# EAGLE design HandController (EAGLE 5.11)
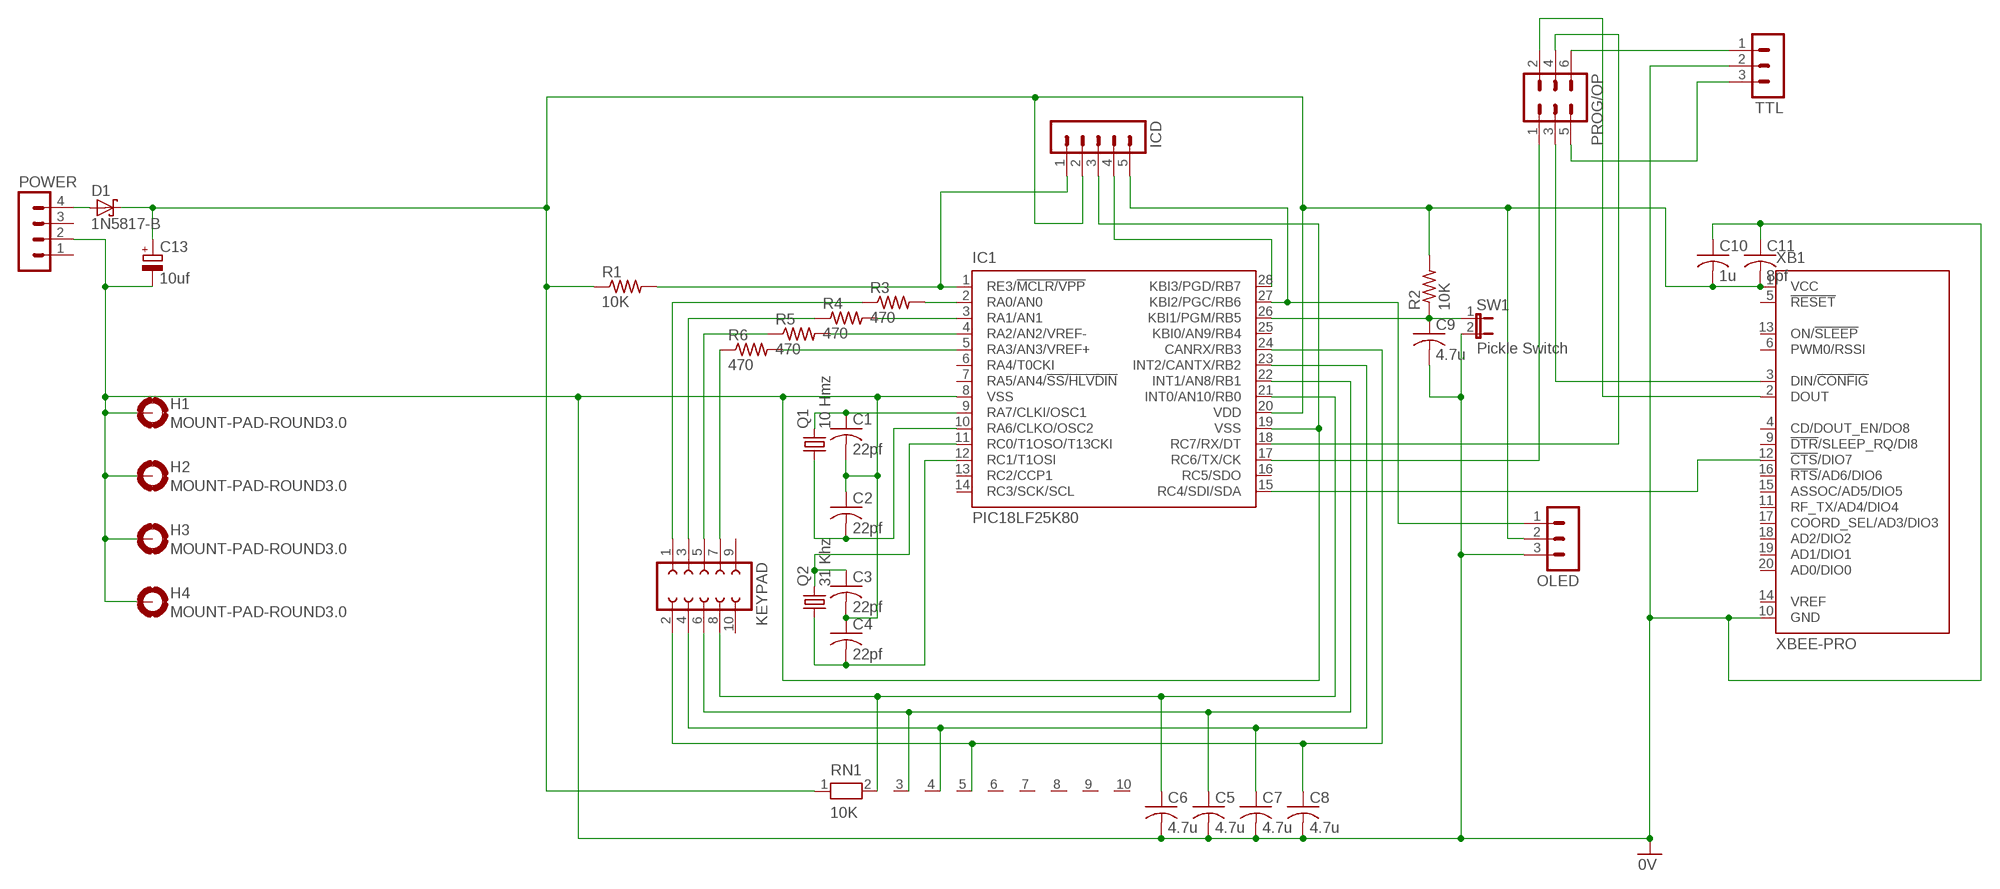
[diagram p0: schematic, sheet 1]

## Parts
C1  22pf  C-US025-024X044  [C025-024X044]
C2  22pf  C-US025-024X044  [C025-024X044]
C3  22pf  C-US025-024X044  [C025-024X044]
C4  22pf  C-US025-024X044  [C025-024X044]
C5  4.7u  C-US025-024X044  [C025-024X044]
C6  4.7u  C-US025-024X044  [C025-024X044]
C7  4.7u  C-US025-024X044  [C025-024X044]
C8  4.7u  C-US025-024X044  [C025-024X044]
C9  4.7u  C-US025-024X044  [C025-024X044]
C10  1u  C-US025-024X044  [C025-024X044]
C11  8pf  C-US025-024X044  [C025-024X044]
C13  10uf  CPOL-EUE2-4  [E2-4]
D1  1N5817-B  [DO41-7.6]
H1  MOUNT-PAD-ROUND3.0  [3,0-PAD]
H2  MOUNT-PAD-ROUND3.0  [3,0-PAD]
H3  MOUNT-PAD-ROUND3.0  [3,0-PAD]
H4  MOUNT-PAD-ROUND3.0  [3,0-PAD]
IC1  PIC18LF25K80  PIC18F2580-I/SP  [DIL28-3]
ICD  MA05-1  [MA05-1]
KEYPAD  FE05-2  [FE05-2]
OLED  MA03-1  [MA03-1]
POWER  MA04-1  [MA04-1]
PROG/OP  MA03-2  [MA03-2]
Q1  10 Hmz  CRYSTALHC18U-V  [HC18U-V]
Q2  31 Khz  CRYSTALTC26H  [TC26H]
R1  10K  R-US_0204/5  [0204/5]
R2  10K  R-US_0204/5  [0204/5]
R3  470  R-US_0204/5  [0204/5]
R4  470  R-US_0204/5  [0204/5]
R5  470  R-US_0204/5  [0204/5]
R6  470  R-US_0204/5  [0204/5]
RN1  10K  RN09  [RN-10]
SW1  Pickle Switch  JP1E  [JP1]
TTL  MA03-1  [MA03-1]
XB1  XBEE-PRO  [XBEE-PRO]

## Nets
GND: C1.2 C2.1 C3.2 C4.1 C5.2 C6.2 C7.2 C8.2 C9.2 C10.1 C11.1 C13.- H1.B3,0(MOUNT) H2.B3,0(MOUNT) H3.B3,0(MOUNT) H4.B3,0(MOUNT) IC1.8(VSS) IC1.19(VSS) ICD.3 OLED.3 POWER.2 SW1.2 TTL.2 XB1.10(GND) ; supply symbol labelled 0V
N$1: C10.2 C11.2 C13.+ D1.C IC1.20(VDD) ICD.2 OLED.2 R1.1 R2.2 RN1.1 XB1.1(VCC)
N$2: IC1.2(RA0/AN0) R3.2
N$3: PROG/OP.3 XB1.3(DIN/!CONFIG)
N$4: KEYPAD.1 R3.1
N$5: IC1.15(RC4/SDI/SDA) XB1.12(!CTS!/DIO7)
N$6: KEYPAD.3 R4.1
N$7: KEYPAD.5 R5.1
N$8: KEYPAD.7 R6.1
N$9: C6.1 IC1.21(INT0/AN10/RB0) KEYPAD.8 RN1.2
N$10: C5.1 IC1.22(INT1/AN8/RB1) KEYPAD.6 RN1.3
N$11: C7.1 IC1.23(INT2/CANTX/RB2) KEYPAD.4 RN1.4
N$12: C8.1 IC1.24(CANRX/RB3) KEYPAD.2 RN1.5
N$13: C1.1 IC1.9(RA7/CLKI/OSC1) Q1.2
N$14: C3.1 IC1.11(RC0/T1OSO/T13CKI) Q2.2
N$15: C4.2 IC1.12(RC1/T1OSI) Q2.1
N$16: C2.2 IC1.10(RA6/CLKO/OSC2) Q1.1
N$17: C9.1 IC1.26(KBI1/PGM/RB5) R2.1 SW1.1
N$19: IC1.3(RA1/AN1) R4.2
N$20: PROG/OP.5 TTL.3
N$21: IC1.4(RA2/AN2/VREF-) R5.2
N$22: IC1.5(RA3/AN3/VREF+) R6.2
N$23: D1.A POWER.4
N$26: IC1.28(KBI3/PGD/RB7) ICD.4
N$27: IC1.1(RE3/!MCLR/VPP) ICD.1 R1.2
N$28: PROG/OP.6 TTL.1
N$29: PROG/OP.2 XB1.2(DOUT)
N$30: IC1.17(RC6/TX/CK) PROG/OP.1
N$31: IC1.18(RC7/RX/DT) PROG/OP.4
N$35: IC1.27(KBI2/PGC/RB6) ICD.5 OLED.1
Unconnected: IC1.6(RA4/T0CKI) IC1.7(RA5/AN4/!SS/HLVDIN) IC1.13(RC2/CCP1) IC1.14(RC3/SCK/SCL) IC1.16(RC5/SDO) IC1.25(KBI0/AN9/RB4) KEYPAD.9 KEYPAD.10 POWER.1 POWER.3 RN1.6 RN1.7 RN1.8 RN1.9 RN1.10 XB1.4(CD/DOUT_EN/DO8) XB1.5(!RESET) XB1.6(PWM0/RSSI) XB1.9(!DTR!/SLEEP_RQ/DI8) XB1.11(RF_TX/AD4/DIO4) XB1.13(ON/!SLEEP) XB1.14(VREF) XB1.15(ASSOC/AD5/DIO5) XB1.16(!RTS!/AD6/DIO6) XB1.17(COORD_SEL/AD3/DIO3) XB1.18(AD2/DIO2) XB1.19(AD1/DIO1) XB1.20(AD0/DIO0)

## Library data of the parts
C1-C11 = rcl:C-US: CAPACITOR, American symbol
C13 = rcl:CPOL-EU: POLARIZED CAPACITOR, European symbol
D1 = diode:1N581*: 1.0A SCHOTTKY BARRIER RECTIFIER Source: http://www.diodes.com/datasheets/ds23001.pdf
H1-H4 = holes:MOUNT-PAD-ROUND: MOUNTING PAD, round
IC1 = microchip:PIC18F2*80: 28-Pin Enhanced Flash Microcontrollers with ECAN(TM) Technology 10-Bit A/D and nanoWatt Technology Source: http://www.microchip.com .. 39637a.pdf; MF: MICROCHIP; MPN: PIC18F2580-I/SP; OC_FARNELL: 9321276; OC_NEWARK: 71J7244
ICD = con-lstb:MA05-1: PIN HEADER; OC_FARNELL: unknown; OC_NEWARK: unknown
KEYPAD = con-lsta:FE05-2: FEMALE HEADER; OC_FARNELL: unknown; OC_NEWARK: unknown
OLED TTL = con-lstb:MA03-1: PIN HEADER; OC_FARNELL: unknown; OC_NEWARK: unknown
POWER = con-lstb:MA04-1: PIN HEADER; OC_FARNELL: unknown; OC_NEWARK: unknown
PROG/OP = con-lstb:MA03-2: PIN HEADER; OC_FARNELL: unknown; OC_NEWARK: unknown
Q1 Q2 = crystal:CRYSTAL: CRYSTAL; OC_FARNELL: unknown; OC_NEWARK: unknown
R1-R6 = resistor:R-US_: RESISTOR, American symbol
RN1 = resistor-net:RN09: RESISTOR NETWORK; OC_FARNELL: unknown; OC_NEWARK: unknown
SW1 = jumper:JP1E: JUMPER
XB1 = maxstream:XBEE: XBee (TM) /XBee-PRO(TM) OEM RF Modules Source: MaxStream, Inc. xbee_productmanual.pdf; MPN: XBP24-AWI-001; OC_FARNELL: 1337916; OC_NEWARK: 42M2667

## Net classes
0 default: width 0.305 mm
1 Gnd: width 0.508 mm

## Board
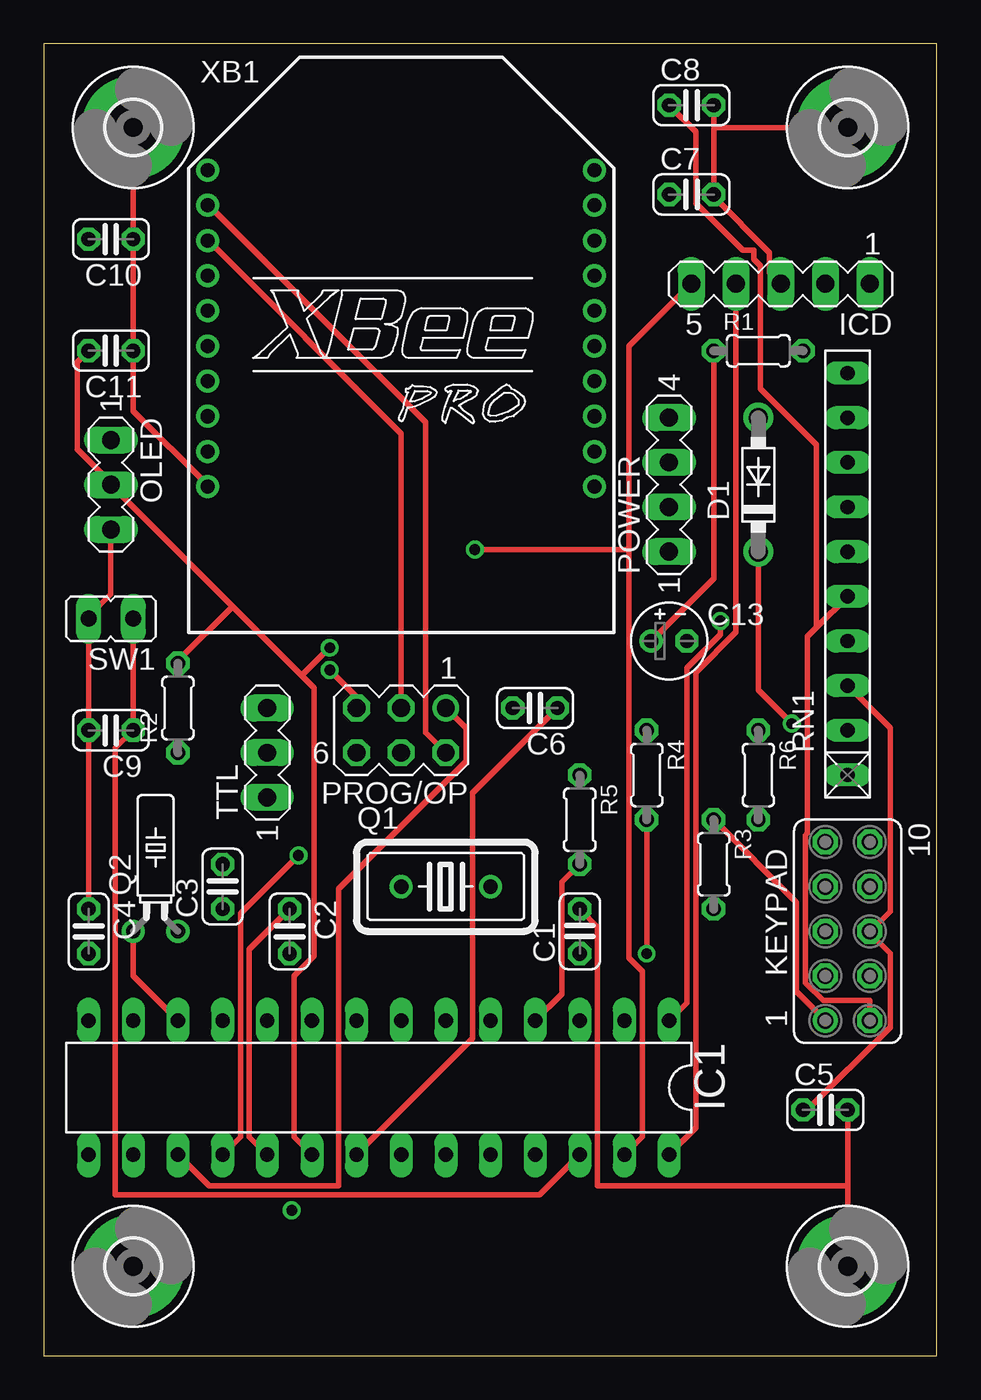
[diagram p1: board, top side]
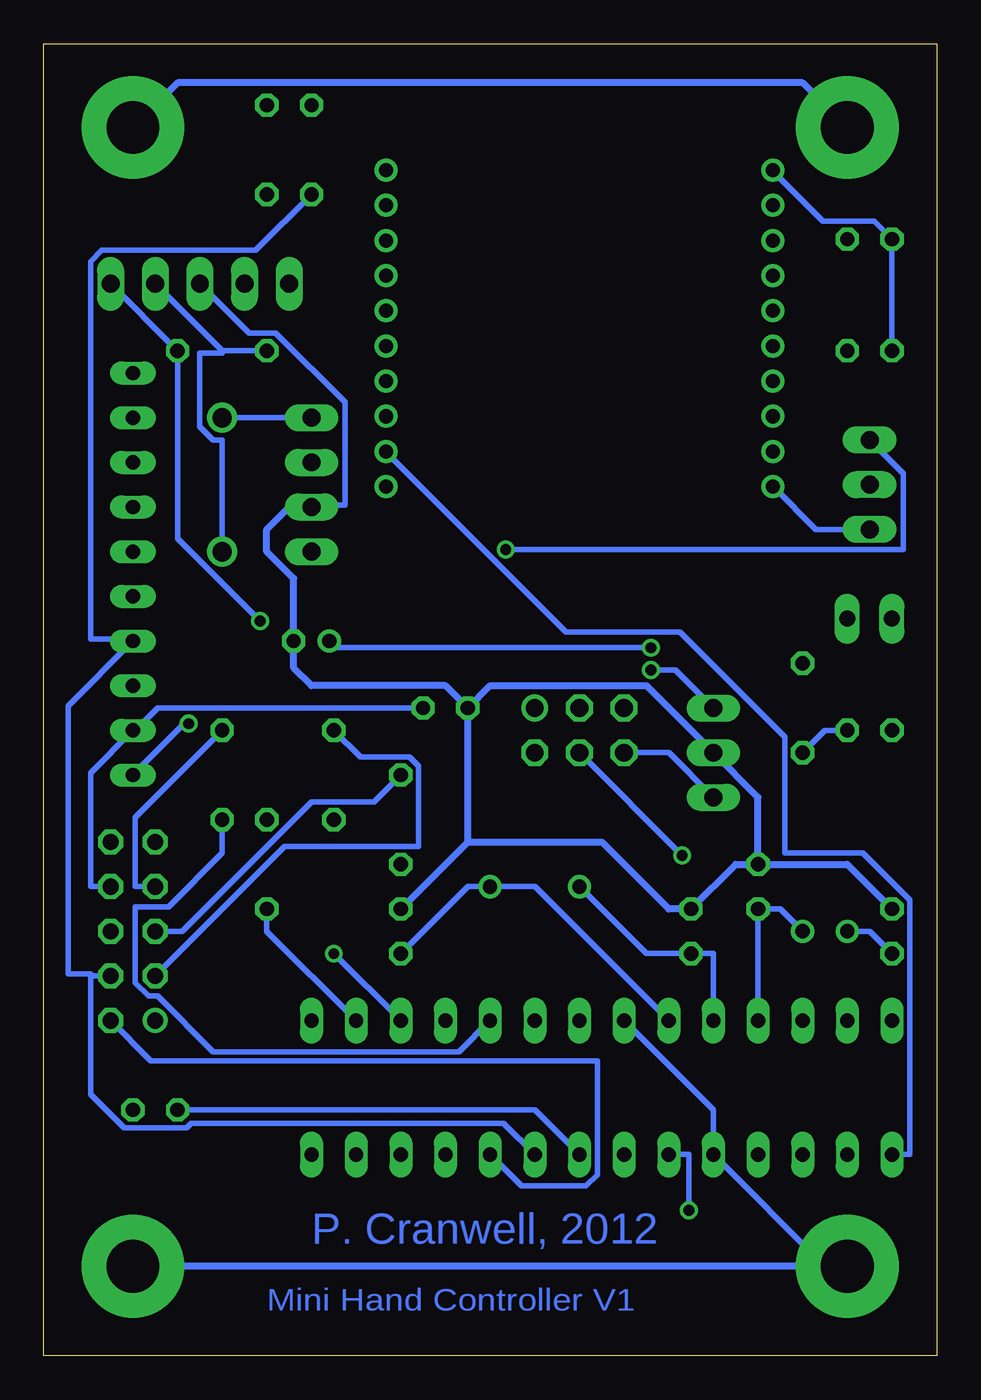
[diagram p2: board, bottom side, seen from below]

Size 50.78 x 74.6 mm. Coordinates in mm from the lower left corner, seen from the top.
Outline: 0,0 50.78,0 50.78,74.6 0,74.6 0,0
Copper layers (1*16): Top 0.035mm / dielectric 1.5mm / Bottom 0.035mm
Design rules "default": minimum track width 10mil, minimum drill 24mil, track to track 8mil, track to pad 8mil, pad to pad 8mil, via to via 8mil, smd to smd 8mil, copper to edge 40mil, drill to drill 8mil, minimum pad ring 10mil, minimum via ring 8mil, stop-mask expansion 4mil, vias tented up to drill 0mil, thermal gap 10mil

### Footprints (pad centres in the part's own frame; a part is rotated, then mirrored left to right if it is on the bottom)
C025-024X044 = drill 0.813 octagon: 1 -1.27,0; 2 1.27,0
E2-4 = drill 0.813 pad 1.27 round: + -1.016,0 | drill 0.813 pad 1.27 octagon: - 1.016,0
DO41-7.6 = drill 1.1 pad 1.7 round: A 3.81,0; C -3.81,0
3,0-PAD = drill 3 pad 5.842 round: B3,0 0,0
DIL28-3 = drill 0.813 long: 1 -16.51,-3.81; 2 -13.97,-3.81; 3 -11.43,-3.81; 4 -8.89,-3.81; 5 -6.35,-3.81; 6 -3.81,-3.81; 7 -1.27,-3.81; 8 1.27,-3.81; 9 3.81,-3.81; 10 6.35,-3.81; 11 8.89,-3.81; 12 11.43,-3.81; 13 13.97,-3.81; 14 16.51,-3.81; 15 16.51,3.81; 16 13.97,3.81; 17 11.43,3.81; 18 8.89,3.81; 19 6.35,3.81; 20 3.81,3.81; 21 1.27,3.81; 22 -1.27,3.81; 23 -3.81,3.81; 24 -6.35,3.81; 25 -8.89,3.81; 26 -11.43,3.81; 27 -13.97,3.81; 28 -16.51,3.81
MA05-1 = drill 1.016 long: 1 -5.08,0; 2 -2.54,0; 3 0,0; 4 2.54,0; 5 5.08,0
FE05-2 = drill 0.914 round: 1 -5.08,1.27 | drill 0.914 octagon: 2 -5.08,-1.27; 3 -2.54,1.27; 4 -2.54,-1.27; 5 0,1.27; 6 0,-1.27; 7 2.54,1.27; 8 2.54,-1.27; 9 5.08,1.27; 10 5.08,-1.27
MA03-1 = drill 1.016 long: 1 -2.54,0; 2 0,0; 3 2.54,0
MA04-1 = drill 1.016 long: 1 -3.81,0; 2 -1.27,0; 3 1.27,0; 4 3.81,0
MA03-2 = drill 1.016 round: 1 -2.54,-1.27 | drill 1.016 octagon: 2 -2.54,1.27; 3 0,-1.27; 4 0,1.27; 5 2.54,-1.27; 6 2.54,1.27
HC18U-V = drill 0.813 round: 1 -2.54,0; 2 2.54,0
TC26H = drill 0.813 round: 1 -1.27,0; 2 1.27,0
0204/5 = drill 0.813 octagon: 1 -2.54,0; 2 2.54,0
RN-10 = drill 0.813 long: 1 -11.43,0; 2 -8.89,0; 3 -6.35,0; 4 -3.81,0; 5 -1.27,0; 6 1.27,0; 7 3.81,0; 8 6.35,0; 9 8.89,0; 10 11.43,0
JP1 = drill 0.914 long: 1 0,-1.27; 2 0,1.27
XBEE-PRO = drill 0.8 pad 1.27 round: 1 -11,9; 2 -11,7; 3 -11,5; 4 -11,3; 5 -11,1; 6 -11,-1; 7 -11,-3; 8 -11,-5; 9 -11,-7; 10 -11,-9; 11 11,-9; 12 11,-7; 13 11,-5; 14 11,-3; 15 11,-1; 16 11,1; 17 11,3; 18 11,5; 19 11,7; 20 11,9

### Placement (x,y rotation side)
C1  30.48,24.13 90 top
C2  13.97,24.13 270 top
C3  10.16,26.67 90 top
C4  2.54,24.13 270 top
C5  44.45,13.97 0 top
C6  27.94,36.83 180 top
C7  36.83,66.04 0 top
C8  36.83,71.12 0 top
C9  3.81,35.56 180 top
C10  3.81,63.5 180 top
C11  3.81,57.15 180 top
C13  35.56,40.64 0 top
D1  40.64,49.53 90 top
H1  5.08,5.08 0 top
H2  45.72,69.85 0 top
H3  5.08,69.85 0 top
H4  45.72,5.08 0 top
IC1  19.05,15.24 180 top
ICD  41.91,60.96 180 top
KEYPAD  45.72,24.13 90 top
OLED  3.81,49.53 270 top
POWER  35.56,49.53 90 top
PROG/OP  20.32,35.56 180 top
Q1  22.86,26.67 0 top
Q2  6.35,24.13 0 top
R1  40.64,57.15 0 top
R2  7.62,36.83 90 top
R3  38.1,27.94 270 top
R4  34.29,33.02 270 top
R5  30.48,30.48 270 top
R6  40.64,33.02 270 top
RN1  45.72,44.45 90 top
SW1  3.81,41.91 90 top
TTL  12.7,34.29 90 top
XB1  20.32,58.42 0 top

### Tracks (layer width: path | path; a pad name or v marks a point on that pad's centre or on a via)
GND
  Top 0.305: OLED.3 3.81,43.31 2.54,42.04 SW1.2 C9.2 C4.1 | H3.B3,0 C10.1 C11.1 5.08,53.72 9.27,49.53 XB1.10 | 38.1,69.85 C8.2 | 38.1,69.85 C7.2 38.1,65.91 41.27,62.74 41.27,61.59 ICD.3 | H2.B3,0 38.1,69.85 | H4.B3,0 45.72,9.65 | 45.72,9.65 C5.2 | C1.2 31.5,24.38 31.5,9.65 45.72,9.65 | IC1.19 11.68,12.45 11.68,23.11 C2.1
  Bottom 0.305: OLED.3 6.86,46.99 9.27,49.4 XB1.10 | H1.B3,0 6.35,5.08 IC1.19 12.7,13.97 IC1.8 | ICD.3 39.12,58.17 37.59,58.17 33.66,54.23 33.66,48.39 35.43,48.39 POWER.2
  Bottom 0.406: POWER.2 36.83,48.26 38.1,46.99 38.1,45.72 36.58,44.2 C13.- 36.58,39.12 35.56,38.1 27.94,38.1 C6.2 | C6.2 25.4,38.1 16.51,38.1 TTL.2 10.16,31.75 C3.2 | C3.2 5.08,27.94 C4.1 | C3.2 11.43,27.94 C2.1 15.24,25.4 19.05,29.21 26.67,29.21 | 26.67,29.21 C6.2 | C1.2 26.67,29.21 | H3.B3,0 7.62,72.39 43.18,72.39 H2.B3,0 | H1.B3,0 H4.B3,0
N$1  (via drill 0.61)
  Top 0.305: v42.55,35.94 40.64,37.85 D1.C | C13.+ 38.1,44.2 R1.1 | IC1.20 14.22,12.45 14.22,21.59 15.37,22.73 15.37,37.97 14.67,38.67 | 14.67,38.67 10.73,42.61 | 10.73,42.61 OLED.2 3.81,49.66 1.91,51.56 1.91,56.52 C11.2 | 14.67,38.67 v16.26,40.26 | R2.2 7.62,39.5 10.73,42.61
  Bottom 0.305: RN1.1 42.8,35.94 v42.55,35.94 | 40.64,57.15 ICD.2 | R1.1 40.64,57.15 | D1.C 40.64,52.07 41.15,52.07 41.91,52.83 41.91,57.02 40.64,57.02 40.64,57.15 | XB1.1 9.27,67.31 6.48,64.52 3.56,64.52 C10.2 C11.2 | C13.+ 34.16,40.26 v16.26,40.26 | v14.1,8.26 14.1,11.43 IC1.20
N$2
  Bottom 0.305: IC1.2 38.1,24.13 R3.2
N$3
  Top 0.305: PROG/OP.3 20.32,52.45 9.4,63.37 XB1.3
N$4
  Top 0.305: R3.1 42.8,25.78 42.8,20.7 KEYPAD.1
N$5
  Bottom 0.305: IC1.15 1.52,11.43 1.52,25.91 4.19,28.57 8.64,28.57 8.64,35.18 14.61,41.15 21.08,41.15 31.24,51.31 XB1.12
N$6
  Bottom 0.305: R4.1 32.77,34.04 29.97,34.04 29.46,33.53 29.46,28.96 37.08,28.96 KEYPAD.3
N$7
  Bottom 0.305: R5.1 32,31.5 35.56,31.5 42.93,24.13 KEYPAD.5
N$8
  Bottom 0.305: R6.1 45.59,30.61 45.59,26.67 KEYPAD.7
N$9
  Top 0.305: IC1.21 24.38,18.03 24.38,32 C6.1
  Bottom 0.305: KEYPAD.8 48.13,26.67 48.13,33.15 RN1.2 45.59,35.56 44.32,36.83 C6.1
N$10
  Top 0.305: RN1.3 48.13,35.69 48.13,25.27 KEYPAD.6 46.99,24 48.13,22.86 48.13,18.67 43.43,13.97 C5.1
  Bottom 0.305: IC1.22 22.86,13.97 C5.1
N$11
  Bottom 0.305: IC1.23 24.64,13.21 42.42,13.21 42.67,12.95 46.23,12.95 48.13,14.86 48.13,21.59 | 48.13,21.59 KEYPAD.4 | 48.13,21.59 48.13,21.72 49.4,21.72 49.4,36.96 RN1.4 45.72,40.77 48.13,40.77 48.13,62.23 47.5,62.87 38.73,62.87 C7.1
N$12
  Top 0.305: 44.01,41.47 43.43,40.89 43.43,29.72 43.31,29.59 43.31,21.21 44.32,20.19 46.99,20.19 KEYPAD.2 | 44.01,41.47 RN1.5 | C8.1 37.08,69.6 37.08,65.53 39.75,62.87 40.39,62.87 40.39,62.36 40.77,61.98 40.77,54.99 43.94,51.82 43.94,41.53 44.01,41.47
  Bottom 0.305: IC1.24 23.62,9.65 19.94,9.65 19.3,10.29 19.3,16.76 44.7,16.76 KEYPAD.2
N$13
  Bottom 0.305: IC1.9 22.86,26.67 Q1.2 26.67,26.67 C1.1
N$14
  Bottom 0.305: Q2.2 8.89,25.4 C3.1 IC1.11
N$15
  Top 0.305: IC1.12 5.08,21.59 Q2.1
  Bottom 0.305: C4.2 3.81,24.13 Q2.1
N$16
  Bottom 0.305: IC1.10 12.7,22.86 C2.2 16.51,22.86 Q1.1
N$17
  Top 0.305: IC1.26 28.19,9.14 4.06,9.14 4.06,34.54 C9.1 SW1.1
  Bottom 0.305: R2.1 6.35,35.56 C9.1
N$19  (via drill 0.61)
  Top 0.305: v34.29,22.86 R4.2
  Bottom 0.305: IC1.3 v34.29,22.86
N$20  (via drill 0.61)
  Top 0.305: v16.26,38.99 17.78,37.47 PROG/OP.5
  Bottom 0.305: TTL.3 14.86,38.99 v16.26,38.99
N$21
  Top 0.305: IC1.4 29.46,20.57 29.46,26.92 R5.2
N$22
  Bottom 0.305: IC1.5 27.18,17.27 41.15,17.27 44.32,20.45 44.83,20.45 45.59,21.21 45.59,25.53 43.69,25.53 40.64,28.57 R6.2
N$23
  Bottom 0.305: POWER.4 D1.A
N$26
  Top 0.305: IC1.28 37.08,12.95 37.08,38.86 39.37,41.15 ICD.4
N$27  (via drill 0.61)
  Top 0.305: IC1.1 36.58,20.07 36.58,39.12 38.48,41.02 v38.48,41.78
  Bottom 0.305: v38.48,41.78 43.18,46.48 R1.2 43.18,57.28 43.31,57.28 ICD.1
N$28
  Bottom 0.305: TTL.1 15.24,34.29 PROG/OP.6
N$29
  Top 0.305: PROG/OP.2 21.72,35.43 21.72,53.09 9.4,65.41 XB1.2
N$30
  Top 0.305: IC1.17 9.4,9.65 16.76,9.65 16.76,26.54 24,33.78 24,35.69 PROG/OP.1
N$31  (via drill 0.61)
  Top 0.305: IC1.18 11.18,12.45 11.18,25.15 v14.48,28.45
  Bottom 0.305: v14.48,28.45 PROG/OP.4
N$35  (via drill 0.61)
  Top 0.305: IC1.27 34.04,12.45 34.04,21.84 33.27,22.61 33.27,45.85 | 33.27,45.85 33.27,57.4 ICD.5 | 33.27,45.85 v24.51,45.85
  Bottom 0.305: OLED.1 1.91,50.16 1.91,45.85 v24.51,45.85

### Text on the board
Bottom: P. Cranwell, 2012 | Mini Hand Controller V1